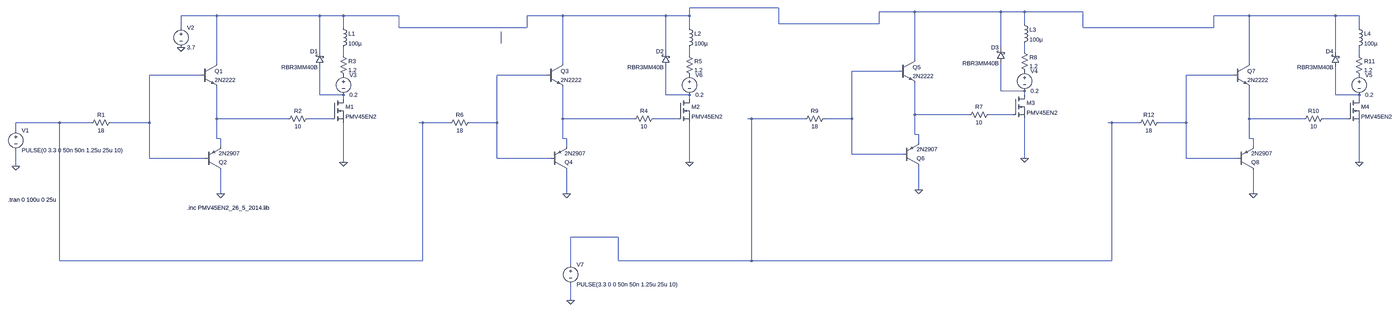
[diagram p0: schematic PushPullInductaneCombo.asc, whole sheet]
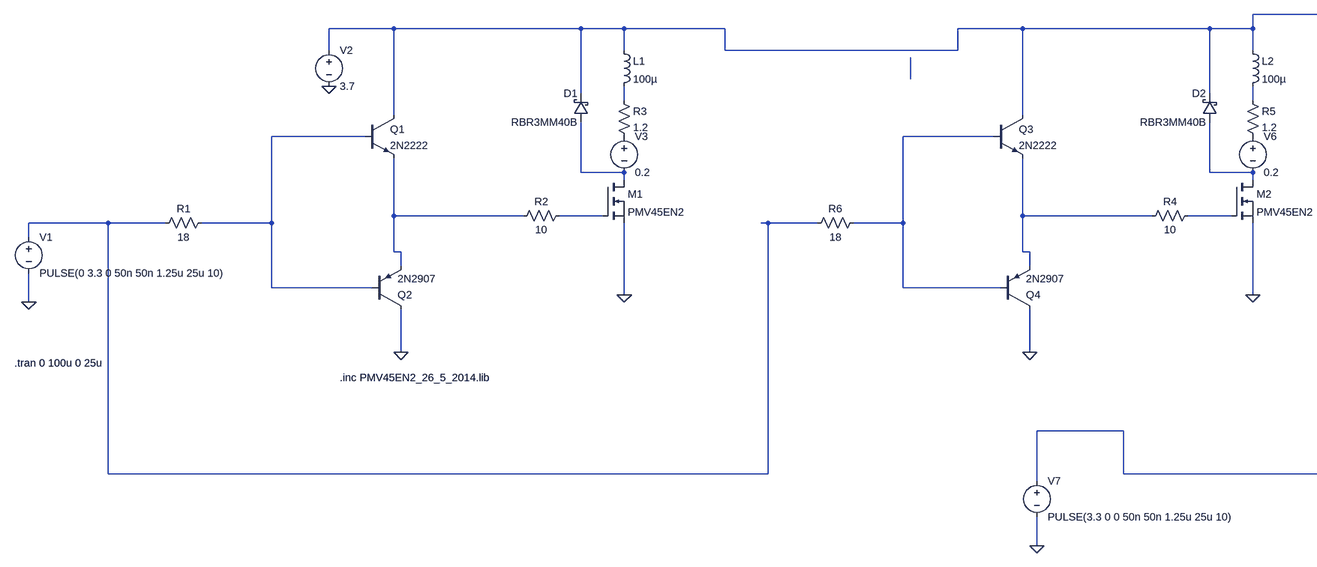
[diagram p1: schematic PushPullInductaneCombo.asc, part, row 1 of 1, column 1 of 2]
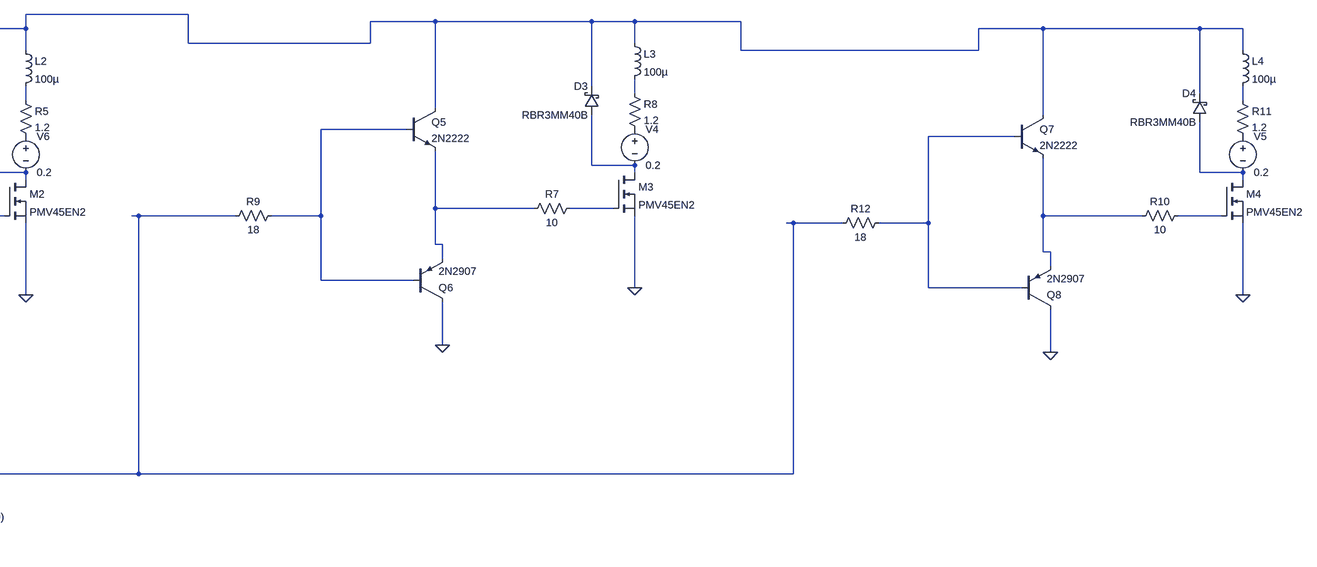
[diagram p2: schematic PushPullInductaneCombo.asc, part, row 1 of 1, column 2 of 2]
PushPullInductaneCombo.asc, the LTspice schematic file:
Version 4
SHEET 1 6092 1092
WIRE 2928 -112 2384 -112
WIRE 3632 -96 3488 -96
WIRE 4048 -96 3632 -96
WIRE 4144 -96 4048 -96
WIRE 4416 -96 4144 -96
WIRE 208 -80 64 -80
WIRE 624 -80 208 -80
WIRE 720 -80 624 -80
WIRE 944 -80 720 -80
WIRE 1872 -80 1728 -80
WIRE 2288 -80 1872 -80
WIRE 2384 -80 2384 -112
WIRE 2384 -80 2288 -80
WIRE 5440 -80 5296 -80
WIRE 5856 -80 5440 -80
WIRE 5952 -80 5856 -80
WIRE 2928 -48 2928 -112
WIRE 3488 -48 3488 -96
WIRE 3488 -48 2928 -48
WIRE 4144 -48 4144 -96
WIRE 64 -32 64 -80
WIRE 720 -32 720 -80
WIRE 944 -32 944 -80
WIRE 1728 -32 1728 -80
WIRE 1728 -32 944 -32
WIRE 2384 -32 2384 -80
WIRE 4416 -32 4416 -96
WIRE 5296 -32 5296 -80
WIRE 5296 -32 4416 -32
WIRE 5952 -32 5952 -80
WIRE 1616 32 1616 -16
WIRE 4048 48 4048 -96
WIRE 624 64 624 -80
WIRE 2288 64 2288 -80
WIRE 4144 64 4144 32
WIRE 5856 64 5856 -80
WIRE 720 80 720 48
WIRE 2384 80 2384 48
WIRE 5952 80 5952 48
WIRE 3632 96 3632 -96
WIRE 208 112 208 -80
WIRE 1872 112 1872 -80
WIRE 5440 112 5440 -80
WIRE 3568 144 3360 144
WIRE 144 160 -64 160
WIRE 1808 160 1600 160
WIRE 5376 160 5168 160
WIRE 4048 224 4048 112
WIRE 4144 224 4048 224
WIRE 624 240 624 128
WIRE 720 240 624 240
WIRE 2288 240 2288 128
WIRE 2384 240 2288 240
WIRE 4144 240 4144 224
WIRE 5856 240 5856 128
WIRE 5952 240 5856 240
WIRE 720 256 720 240
WIRE 2384 256 2384 240
WIRE 5952 256 5952 240
WIRE 3632 320 3632 192
WIRE 3920 320 3632 320
WIRE 4096 320 4000 320
WIRE 208 336 208 208
WIRE 496 336 208 336
WIRE 672 336 576 336
WIRE 1872 336 1872 208
WIRE 2160 336 1872 336
WIRE 2336 336 2240 336
WIRE 2800 336 2784 336
WIRE 3088 336 2800 336
WIRE 3360 336 3360 144
WIRE 3360 336 3168 336
WIRE 5440 336 5440 208
WIRE 5728 336 5440 336
WIRE 5904 336 5808 336
WIRE -464 352 -640 352
WIRE -336 352 -464 352
WIRE -64 352 -64 160
WIRE -64 352 -256 352
WIRE 1040 352 1024 352
WIRE 1328 352 1040 352
WIRE 1600 352 1600 160
WIRE 1600 352 1408 352
WIRE 4608 352 4592 352
WIRE 4896 352 4608 352
WIRE 5168 352 5168 160
WIRE 5168 352 4976 352
WIRE -640 384 -640 352
WIRE 3632 400 3632 320
WIRE 3648 400 3632 400
WIRE 208 416 208 336
WIRE 224 416 208 416
WIRE 1872 416 1872 336
WIRE 1888 416 1872 416
WIRE 5440 416 5440 336
WIRE 5456 416 5440 416
WIRE 3648 432 3648 400
WIRE 224 448 224 416
WIRE 1888 448 1888 416
WIRE 5456 448 5456 416
WIRE 3360 480 3360 336
WIRE 3584 480 3360 480
WIRE -64 496 -64 352
WIRE 160 496 -64 496
WIRE 1600 496 1600 352
WIRE 1824 496 1600 496
WIRE 4144 496 4144 336
WIRE 5168 496 5168 352
WIRE 5392 496 5168 496
WIRE 720 512 720 352
WIRE 2384 512 2384 352
WIRE 5952 512 5952 352
WIRE -640 528 -640 464
WIRE 3648 624 3648 528
WIRE 224 640 224 544
WIRE 1888 640 1888 544
WIRE 5456 640 5456 544
WIRE 2096 816 1904 816
WIRE -464 912 -464 352
WIRE 1040 912 1040 352
WIRE 1040 912 -464 912
WIRE 2096 912 2096 816
WIRE 2800 912 2800 336
WIRE 2800 912 2096 912
WIRE 4608 912 4608 352
WIRE 4608 912 2800 912
WIRE 1904 928 1904 816
WIRE 1904 1072 1904 1008
FLAG -640 528 0
FLAG 224 640 0
FLAG 64 48 0
FLAG 720 512 0
FLAG 1888 640 0
FLAG 2384 512 0
FLAG 3648 624 0
FLAG 4144 496 0
FLAG 5456 640 0
FLAG 5952 512 0
FLAG 1904 1072 0
SYMBOL npn 144 112 R0
SYMATTR InstName Q1
SYMATTR Value 2N2222
SYMBOL pnp 160 544 M180
SYMATTR InstName Q2
SYMATTR Value 2N2907
SYMBOL voltage -640 368 R0
WINDOW 123 0 0 Left 0
WINDOW 39 0 0 Left 0
SYMATTR InstName V1
SYMATTR Value PULSE(0 3.3 0 50n 50n 1.25u 25u 10)
SYMBOL voltage 64 -48 R0
WINDOW 123 0 0 Left 0
WINDOW 39 0 0 Left 0
SYMATTR InstName V2
SYMATTR Value 3.7
SYMBOL res 480 352 R270
WINDOW 0 32 56 VTop 2
WINDOW 3 0 56 VBottom 2
SYMATTR InstName R2
SYMATTR Value 10
SYMBOL res 704 64 R0
SYMATTR InstName R3
SYMATTR Value 1.2
SYMBOL nmos 672 256 R0
SYMATTR InstName M1
SYMATTR Value PMV45EN2
SYMATTR Prefix X
SYMBOL schottky 640 128 R180
WINDOW 0 24 64 Left 2
WINDOW 3 24 0 Left 2
SYMATTR InstName D1
SYMATTR Value RBR3MM40B
SYMATTR Description Diode
SYMATTR Type diode
SYMBOL res -240 336 R90
WINDOW 0 0 56 VBottom 2
WINDOW 3 32 56 VTop 2
SYMATTR InstName R1
SYMATTR Value 18
SYMBOL ind 704 -48 R0
SYMATTR InstName L1
SYMATTR Value 100µ
SYMBOL voltage 720 144 R0
WINDOW 123 0 0 Left 0
WINDOW 39 0 0 Left 0
SYMATTR InstName V3
SYMATTR Value 0.2
SYMBOL npn 1808 112 R0
SYMATTR InstName Q3
SYMATTR Value 2N2222
SYMBOL pnp 1824 544 M180
SYMATTR InstName Q4
SYMATTR Value 2N2907
SYMBOL res 2144 352 R270
WINDOW 0 32 56 VTop 2
WINDOW 3 0 56 VBottom 2
SYMATTR InstName R4
SYMATTR Value 10
SYMBOL res 2368 64 R0
SYMATTR InstName R5
SYMATTR Value 1.2
SYMBOL nmos 2336 256 R0
SYMATTR InstName M2
SYMATTR Value PMV45EN2
SYMATTR Prefix X
SYMBOL schottky 2304 128 R180
WINDOW 0 24 64 Left 2
WINDOW 3 24 0 Left 2
SYMATTR InstName D2
SYMATTR Value RBR3MM40B
SYMATTR Description Diode
SYMATTR Type diode
SYMBOL res 1424 336 R90
WINDOW 0 0 56 VBottom 2
WINDOW 3 32 56 VTop 2
SYMATTR InstName R6
SYMATTR Value 18
SYMBOL ind 2368 -48 R0
SYMATTR InstName L2
SYMATTR Value 100µ
SYMBOL voltage 2384 144 R0
WINDOW 123 0 0 Left 0
WINDOW 39 0 0 Left 0
SYMATTR InstName V6
SYMATTR Value 0.2
SYMBOL npn 3568 96 R0
SYMATTR InstName Q5
SYMATTR Value 2N2222
SYMBOL pnp 3584 528 M180
SYMATTR InstName Q6
SYMATTR Value 2N2907
SYMBOL res 3904 336 R270
WINDOW 0 32 56 VTop 2
WINDOW 3 0 56 VBottom 2
SYMATTR InstName R7
SYMATTR Value 10
SYMBOL res 4128 48 R0
SYMATTR InstName R8
SYMATTR Value 1.2
SYMBOL nmos 4096 240 R0
SYMATTR InstName M3
SYMATTR Value PMV45EN2
SYMATTR Prefix X
SYMBOL schottky 4064 112 R180
WINDOW 0 24 64 Left 2
WINDOW 3 24 0 Left 2
SYMATTR InstName D3
SYMATTR Value RBR3MM40B
SYMATTR Description Diode
SYMATTR Type diode
SYMBOL res 3184 320 R90
WINDOW 0 0 56 VBottom 2
WINDOW 3 32 56 VTop 2
SYMATTR InstName R9
SYMATTR Value 18
SYMBOL ind 4128 -64 R0
SYMATTR InstName L3
SYMATTR Value 100µ
SYMBOL voltage 4144 128 R0
WINDOW 123 0 0 Left 0
WINDOW 39 0 0 Left 0
SYMATTR InstName V4
SYMATTR Value 0.2
SYMBOL npn 5376 112 R0
SYMATTR InstName Q7
SYMATTR Value 2N2222
SYMBOL pnp 5392 544 M180
SYMATTR InstName Q8
SYMATTR Value 2N2907
SYMBOL res 5712 352 R270
WINDOW 0 32 56 VTop 2
WINDOW 3 0 56 VBottom 2
SYMATTR InstName R10
SYMATTR Value 10
SYMBOL res 5936 64 R0
SYMATTR InstName R11
SYMATTR Value 1.2
SYMBOL nmos 5904 256 R0
SYMATTR InstName M4
SYMATTR Value PMV45EN2
SYMATTR Prefix X
SYMBOL schottky 5872 128 R180
WINDOW 0 24 64 Left 2
WINDOW 3 24 0 Left 2
SYMATTR InstName D4
SYMATTR Value RBR3MM40B
SYMATTR Description Diode
SYMATTR Type diode
SYMBOL res 4992 336 R90
WINDOW 0 0 56 VBottom 2
WINDOW 3 32 56 VTop 2
SYMATTR InstName R12
SYMATTR Value 18
SYMBOL ind 5936 -48 R0
SYMATTR InstName L4
SYMATTR Value 100µ
SYMBOL voltage 5952 144 R0
WINDOW 123 0 0 Left 0
WINDOW 39 0 0 Left 0
SYMATTR InstName V5
SYMATTR Value 0.2
SYMBOL voltage 1904 912 R0
WINDOW 123 0 0 Left 0
WINDOW 39 0 0 Left 0
SYMATTR InstName V7
SYMATTR Value PULSE(3.3 0 0 50n 50n 1.25u 25u 10)
TEXT -672 664 Left 2 !.tran 0 100u 0 25u
TEXT 88 696 Left 2 !.inc PMV45EN2_26_5_2014.lib

The netlist it stands for:
* PushPullInductaneCombo.asc
Q1 N001 N008 N017 0 2N2222
Q2 0 N008 N017 0 2N2907
V1 N024 0 PULSE(0 3.3 0 50n 50n 1.25u 25u 10)
V2 N001 0 3.7
R2 N017 N018 10
R3 N004 P001 1.2
XM1 N012 N018 0 PMV45EN2  ; pins D G S
D1 N012 N001 RBR3MM40B
R1 N008 N024 18
L1 N001 N004 100µ
V3 P001 N012 0.2
Q3 N001 N009 N019 0 2N2222
Q4 0 N009 N019 0 2N2907
R4 N019 N020 10
R5 N005 P002 1.2
XM2 N013 N020 0 PMV45EN2  ; pins D G S
D2 N013 N001 RBR3MM40B
R6 N009 N024 18
L2 N001 N005 100µ
V6 P002 N013 0.2
Q5 N001 N007 N015 0 2N2222
Q6 0 N007 N015 0 2N2907
R7 N015 N016 10
R8 N003 P003 1.2
XM3 N011 N016 0 PMV45EN2  ; pins D G S
D3 N011 N001 RBR3MM40B
R9 N007 N021 18
L3 N001 N003 100µ
V4 P003 N011 0.2
Q7 N001 N010 N022 0 2N2222
Q8 0 N010 N022 0 2N2907
R10 N022 N023 10
R11 N006 P004 1.2
XM4 N014 N023 0 PMV45EN2  ; pins D G S
D4 N014 N001 RBR3MM40B
R12 N010 N021 18
L4 N001 N006 100µ
V5 P004 N014 0.2
V7 N021 0 PULSE(3.3 0 0 50n 50n 1.25u 25u 10)
.model D D
.lib standard.dio
.model NPN NPN
.model PNP PNP
.lib standard.bjt
.tran 0 100u 0 25u
.inc PMV45EN2_26_5_2014.lib
.backanno
.end